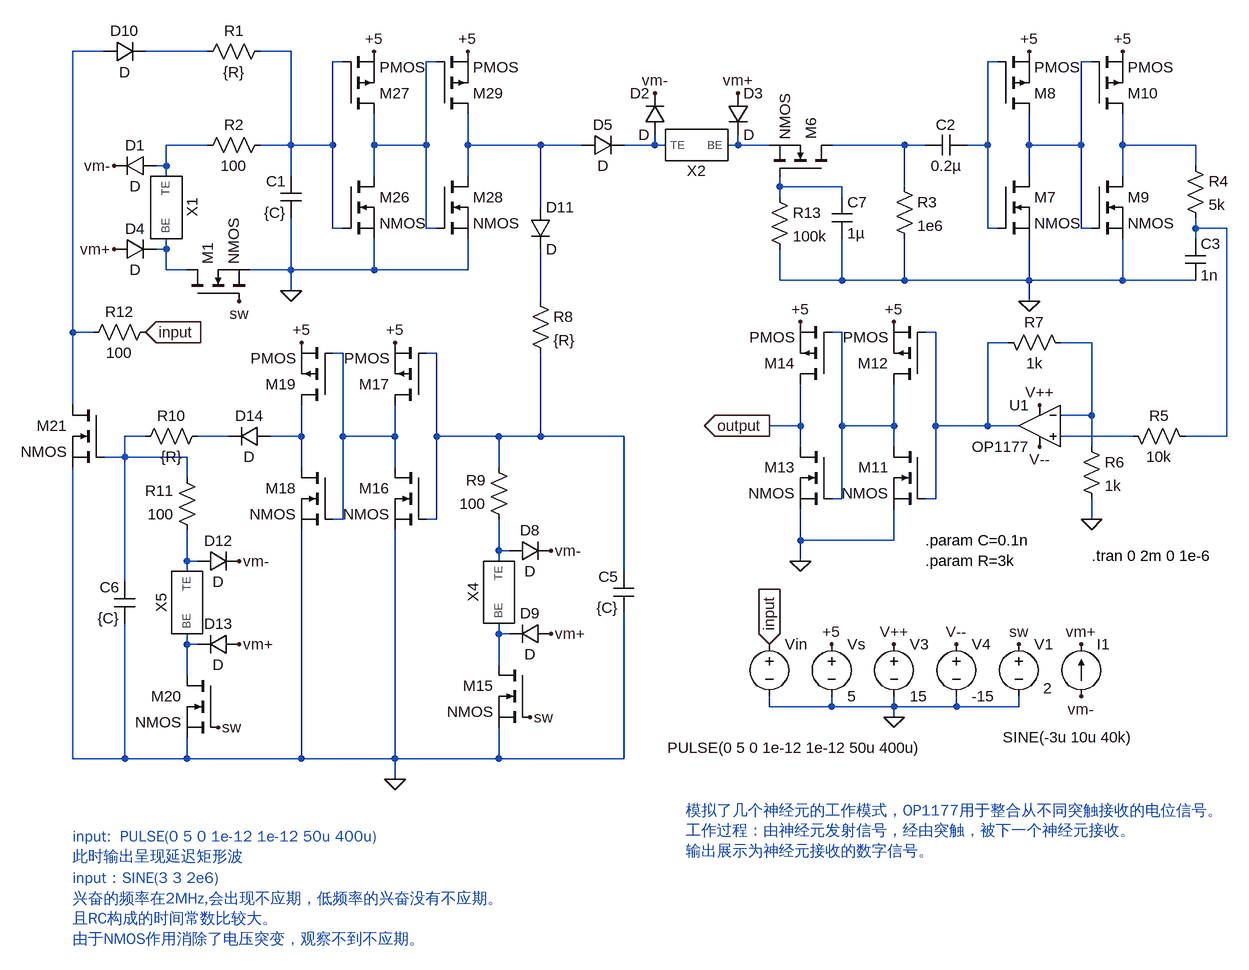
[diagram p0: schematic 神经元-突触-神经元.asc]
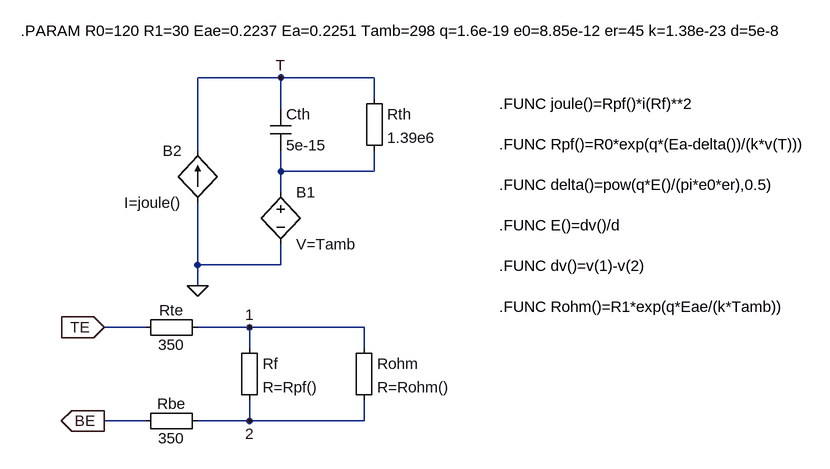
[diagram p1: sub-circuit 神经元拟合.asc]
神经元-突触-神经元.asc, the LTspice schematic file:
Version 4
SHEET 1 2424 1908
WIRE 144 112 96 112
WIRE 304 112 208 112
WIRE 432 112 384 112
WIRE 512 128 496 128
WIRE 656 128 640 128
WIRE 1520 128 1504 128
WIRE 1664 128 1648 128
WIRE 304 256 240 256
WIRE 432 256 432 112
WIRE 432 256 384 256
WIRE 496 256 496 128
WIRE 496 256 432 256
WIRE 560 256 560 208
WIRE 640 256 640 128
WIRE 640 256 560 256
WIRE 704 256 704 208
WIRE 816 256 704 256
WIRE 880 256 816 256
WIRE 992 256 992 240
WIRE 992 256 944 256
WIRE 1008 256 992 256
WIRE 1120 256 1120 240
WIRE 1120 256 1104 256
WIRE 1168 256 1120 256
WIRE 1376 256 1264 256
WIRE 1408 256 1376 256
WIRE 1504 256 1504 128
WIRE 1504 256 1472 256
WIRE 1568 256 1568 208
WIRE 1648 256 1648 128
WIRE 1648 256 1568 256
WIRE 1712 256 1712 208
WIRE 1824 256 1712 256
WIRE 240 288 240 256
WIRE 240 288 224 288
WIRE 1824 288 1824 256
WIRE 240 304 240 288
WIRE 432 304 432 256
WIRE 560 304 560 256
WIRE 704 304 704 256
WIRE 1568 304 1568 256
WIRE 1712 304 1712 256
WIRE 1184 320 1184 304
WIRE 1280 320 1184 320
WIRE 1376 320 1376 256
WIRE 1184 336 1184 320
WIRE 1280 336 1280 320
WIRE 816 352 816 256
WIRE 496 384 496 256
WIRE 512 384 496 384
WIRE 640 384 640 256
WIRE 656 384 640 384
WIRE 1504 384 1504 256
WIRE 1520 384 1504 384
WIRE 1648 384 1648 256
WIRE 1664 384 1648 384
WIRE 1824 384 1824 368
WIRE 1872 384 1824 384
WIRE 1824 400 1824 384
WIRE 240 416 240 400
WIRE 240 416 224 416
WIRE 240 448 240 416
WIRE 272 448 240 448
WIRE 432 448 432 368
WIRE 432 448 368 448
WIRE 560 448 560 400
WIRE 560 448 432 448
WIRE 704 448 704 400
WIRE 704 448 560 448
WIRE 1184 464 1184 416
WIRE 1280 464 1280 400
WIRE 1280 464 1184 464
WIRE 1376 464 1376 400
WIRE 1376 464 1280 464
WIRE 1568 464 1568 400
WIRE 1568 464 1376 464
WIRE 1712 464 1712 400
WIRE 1712 464 1568 464
WIRE 1824 464 1712 464
WIRE 432 480 432 448
WIRE 816 496 816 416
WIRE 1568 496 1568 464
WIRE 96 544 96 112
WIRE 128 544 96 544
WIRE 1280 544 1264 544
WIRE 1424 544 1408 544
WIRE 1536 560 1504 560
WIRE 1664 560 1616 560
WIRE 512 576 496 576
WIRE 656 576 640 576
WIRE 96 656 96 544
WIRE 1664 672 1664 560
WIRE 1664 672 1616 672
WIRE 1216 688 1216 624
WIRE 1216 688 1168 688
WIRE 1280 688 1280 544
WIRE 1360 688 1360 624
WIRE 1360 688 1280 688
WIRE 1424 688 1424 544
WIRE 1504 688 1504 560
WIRE 1504 688 1424 688
WIRE 1552 688 1504 688
WIRE 208 704 176 704
WIRE 336 704 288 704
WIRE 448 704 448 656
WIRE 448 704 400 704
WIRE 512 704 512 576
WIRE 592 704 592 656
WIRE 592 704 512 704
WIRE 656 704 656 576
WIRE 752 704 656 704
WIRE 816 704 816 576
WIRE 816 704 752 704
WIRE 944 704 816 704
WIRE 1728 704 1616 704
WIRE 1872 704 1872 384
WIRE 1872 704 1808 704
WIRE 1216 720 1216 688
WIRE 1360 720 1360 688
WIRE 1664 720 1664 672
WIRE 176 736 176 704
WIRE 176 736 144 736
WIRE 272 736 176 736
WIRE 448 752 448 704
WIRE 592 752 592 704
WIRE 752 752 752 704
WIRE 272 768 272 736
WIRE 1280 800 1280 688
WIRE 1280 800 1264 800
WIRE 1424 800 1424 688
WIRE 1424 800 1408 800
WIRE 512 832 512 704
WIRE 512 832 496 832
WIRE 656 832 656 704
WIRE 656 832 640 832
WIRE 1664 832 1664 800
WIRE 1216 864 1216 816
WIRE 1360 864 1360 816
WIRE 1360 864 1216 864
WIRE 752 880 752 832
WIRE 768 880 752 880
WIRE 272 896 272 848
WIRE 288 896 272 896
WIRE 752 896 752 880
WIRE 1216 896 1216 864
WIRE 272 912 272 896
WIRE 944 912 944 704
WIRE 176 928 176 736
WIRE 752 1008 752 992
WIRE 768 1008 752 1008
WIRE 272 1024 272 1008
WIRE 288 1024 272 1024
WIRE 752 1056 752 1008
WIRE 272 1072 272 1024
WIRE 1168 1120 1168 1104
WIRE 1264 1120 1264 1104
WIRE 1264 1120 1168 1120
WIRE 1360 1120 1360 1104
WIRE 1360 1120 1264 1120
WIRE 1456 1120 1456 1104
WIRE 1456 1120 1360 1120
WIRE 1552 1120 1552 1104
WIRE 1552 1120 1456 1120
WIRE 1360 1136 1360 1120
WIRE 96 1200 96 752
WIRE 176 1200 176 992
WIRE 176 1200 96 1200
WIRE 272 1200 272 1168
WIRE 272 1200 176 1200
WIRE 448 1200 448 848
WIRE 448 1200 272 1200
WIRE 592 1200 592 848
WIRE 592 1200 448 1200
WIRE 752 1200 752 1152
WIRE 752 1200 592 1200
WIRE 944 1200 944 976
WIRE 944 1200 752 1200
WIRE 592 1232 592 1200
FLAG 1648 1024 vm+
FLAG 1648 1104 vm-
FLAG 1552 1024 sw
FLAG 352 496 sw
FLAG 1168 1024 input
IOPIN 1168 1024 In
FLAG 208 544 input
IOPIN 208 544 In
FLAG 1264 1024 +5
FLAG 1360 1024 V++
FLAG 1456 1024 V--
FLAG 1584 656 V++
FLAG 1584 720 V--
FLAG 1168 688 output
IOPIN 1168 688 Out
FLAG 800 1136 sw
FLAG 832 880 vm-
FLAG 832 1008 vm+
FLAG 592 560 +5
FLAG 448 560 +5
FLAG 432 480 0
FLAG 320 1152 sw
FLAG 352 896 vm-
FLAG 352 1024 vm+
FLAG 592 1232 0
FLAG 1360 528 +5
FLAG 1216 528 +5
FLAG 1568 112 +5
FLAG 1712 112 +5
FLAG 992 176 vm-
FLAG 1120 176 vm+
FLAG 560 112 +5
FLAG 704 112 +5
FLAG 160 288 vm-
FLAG 160 416 vm+
FLAG 1360 1136 0
FLAG 1568 496 0
FLAG 1216 896 0
FLAG 1664 832 0
SYMBOL current 1648 1104 R180
WINDOW 0 -44 80 Left 2
WINDOW 3 -80 -63 Left 2
WINDOW 123 0 0 Left 0
WINDOW 39 0 0 Left 0
SYMATTR InstName I1
SYMATTR Value SINE(-3u 10u 40k)
SYMBOL voltage 1552 1008 R0
WINDOW 3 38 84 Left 2
WINDOW 123 0 0 Left 0
WINDOW 39 0 0 Left 0
SYMATTR Value 2
SYMATTR InstName V1
SYMBOL voltage 1168 1008 R0
WINDOW 123 0 0 Left 0
WINDOW 39 0 0 Left 0
WINDOW 3 -157 175 Left 2
SYMATTR Value PULSE(0 5 0 1e-12 1e-12 50u 400u)
SYMATTR InstName Vin
SYMBOL res 288 128 R270
WINDOW 0 32 56 VTop 2
WINDOW 3 0 56 VBottom 2
SYMATTR InstName R1
SYMATTR Value {R}
SYMBOL cap 448 368 R180
WINDOW 0 24 56 Left 2
WINDOW 3 24 8 Left 2
SYMATTR InstName C1
SYMATTR Value {C}
SYMBOL res 400 240 R90
WINDOW 0 0 56 VBottom 2
WINDOW 3 32 56 VTop 2
SYMATTR InstName R2
SYMATTR Value 100
SYMBOL nmos 272 496 R270
SYMATTR InstName M1
SYMBOL voltage 1264 1008 R0
WINDOW 123 0 0 Left 0
WINDOW 39 0 0 Left 0
SYMATTR InstName Vs
SYMATTR Value 5
SYMBOL diode 880 272 R270
WINDOW 0 32 32 VTop 2
WINDOW 3 0 32 VBottom 2
SYMATTR InstName D5
SYMBOL nmos 1264 304 M270
SYMATTR InstName M6
SYMBOL res 1360 304 R0
SYMATTR InstName R3
SYMATTR Value 1e6
SYMBOL cap 1472 240 R90
WINDOW 0 0 32 VBottom 2
WINDOW 3 32 32 VTop 2
SYMATTR InstName C2
SYMATTR Value 0.2µ
SYMBOL res 1808 272 R0
SYMATTR InstName R4
SYMATTR Value 5k
SYMBOL cap 1808 400 R0
SYMATTR InstName C3
SYMATTR Value 1n
SYMBOL res 1712 688 M90
WINDOW 0 0 56 VBottom 2
WINDOW 3 32 56 VTop 2
SYMATTR InstName R5
SYMATTR Value 10k
SYMBOL OpAmps\\OP1177 1584 624 M0
SYMATTR InstName U1
SYMBOL voltage 1360 1008 R0
WINDOW 123 0 0 Left 0
WINDOW 39 0 0 Left 0
SYMATTR InstName V3
SYMATTR Value 15
SYMBOL voltage 1456 1008 R0
WINDOW 123 0 0 Left 0
WINDOW 39 0 0 Left 0
SYMATTR InstName V4
SYMATTR Value -15
SYMBOL res 1520 544 M90
WINDOW 0 0 56 VBottom 2
WINDOW 3 32 56 VTop 2
SYMATTR InstName R7
SYMATTR Value 1k
SYMBOL res 800 480 R0
SYMATTR InstName R8
SYMATTR Value {R}
SYMBOL cap 960 976 R180
WINDOW 0 24 56 Left 2
WINDOW 3 24 8 Left 2
SYMATTR InstName C5
SYMATTR Value {C}
SYMBOL res 768 848 R180
WINDOW 0 36 76 Left 2
WINDOW 3 36 40 Left 2
SYMATTR InstName R9
SYMATTR Value 100
SYMBOL nmos 800 1056 M0
SYMATTR InstName M15
SYMBOL diode 768 896 R270
WINDOW 0 32 32 VTop 2
WINDOW 3 0 32 VBottom 2
SYMATTR InstName D8
SYMBOL diode 832 992 R90
WINDOW 0 0 32 VBottom 2
WINDOW 3 32 32 VTop 2
SYMATTR InstName D9
SYMBOL 神经元拟合 752 944 M90
SYMATTR InstName X4
SYMBOL nmos 640 752 M0
SYMATTR InstName M16
SYMBOL pmos 640 656 R180
SYMATTR InstName M17
SYMBOL nmos 496 752 M0
SYMATTR InstName M18
SYMBOL pmos 496 656 R180
SYMATTR InstName M19
SYMBOL diode 144 128 R270
WINDOW 0 32 32 VTop 2
WINDOW 3 0 32 VBottom 2
SYMATTR InstName D10
SYMBOL diode 800 352 R0
SYMATTR InstName D11
SYMBOL res 192 720 R270
WINDOW 0 32 56 VTop 2
WINDOW 3 0 56 VBottom 2
SYMATTR InstName R10
SYMATTR Value {R}
SYMBOL cap 192 992 R180
WINDOW 0 24 56 Left 2
WINDOW 3 24 8 Left 2
SYMATTR InstName C6
SYMATTR Value {C}
SYMBOL res 288 864 R180
WINDOW 0 36 76 Left 2
WINDOW 3 36 40 Left 2
SYMATTR InstName R11
SYMATTR Value 100
SYMBOL nmos 320 1072 M0
SYMATTR InstName M20
SYMBOL diode 288 912 R270
WINDOW 0 32 32 VTop 2
WINDOW 3 0 32 VBottom 2
SYMATTR InstName D12
SYMBOL diode 352 1008 R90
WINDOW 0 0 32 VBottom 2
WINDOW 3 32 32 VTop 2
SYMATTR InstName D13
SYMBOL 神经元拟合 272 960 M90
SYMATTR InstName X5
SYMBOL diode 400 688 R90
WINDOW 0 0 32 VBottom 2
WINDOW 3 32 32 VTop 2
SYMATTR InstName D14
SYMBOL nmos 144 656 M0
SYMATTR InstName M21
SYMBOL res 224 528 R90
WINDOW 0 0 56 VBottom 2
WINDOW 3 32 56 VTop 2
SYMATTR InstName R12
SYMATTR Value 100
SYMBOL res 1168 320 R0
SYMATTR InstName R13
SYMATTR Value 100k
SYMBOL cap 1264 336 R0
SYMATTR InstName C7
SYMATTR Value 1µ
SYMBOL nmos 1408 720 M0
SYMATTR InstName M11
SYMBOL pmos 1408 624 R180
SYMATTR InstName M12
SYMBOL nmos 1264 720 M0
SYMATTR InstName M13
SYMBOL pmos 1264 624 R180
SYMATTR InstName M14
SYMBOL nmos 1520 304 R0
SYMATTR InstName M7
SYMBOL pmos 1520 208 M180
SYMATTR InstName M8
SYMBOL nmos 1664 304 R0
SYMATTR InstName M9
SYMBOL pmos 1664 208 M180
SYMATTR InstName M10
SYMBOL diode 1008 240 R180
WINDOW 0 24 64 Left 2
WINDOW 3 24 0 Left 2
SYMATTR InstName D2
SYMBOL diode 1104 176 R0
SYMATTR InstName D3
SYMBOL 神经元拟合 1056 256 M180
SYMATTR InstName X2
SYMBOL nmos 512 304 R0
SYMATTR InstName M26
SYMBOL pmos 512 208 M180
SYMATTR InstName M27
SYMBOL nmos 656 304 R0
SYMATTR InstName M28
SYMBOL pmos 656 208 M180
SYMATTR InstName M29
SYMBOL diode 224 304 M270
WINDOW 0 32 32 VTop 2
WINDOW 3 0 32 VBottom 2
SYMATTR InstName D1
SYMBOL diode 160 400 M90
WINDOW 0 0 32 VBottom 2
WINDOW 3 32 32 VTop 2
SYMATTR InstName D4
SYMBOL 神经元拟合 240 352 R90
SYMATTR InstName X1
SYMBOL res 1648 704 R0
SYMATTR InstName R6
SYMATTR Value 1k
TEXT 1664 888 Left 2 !.tran 0 2m 0 1e-6
TEXT 1408 864 Left 2 !.param C=0.1n\n.param R=3k
TEXT 96 1320 Left 2 ;input:  PULSE(0 5 0 1e-12 1e-12 50u 400u)\n此时输出呈现延迟矩形波
TEXT 96 1384 Left 2 ;input：SINE(3 3 2e6)\n兴奋的频率在2MHz,会出现不应期，低频率的兴奋没有不应期。\n且RC构成的时间常数比较大。\n由于NMOS作用消除了电压突变，观察不到不应期。
TEXT 1040 1280 Left 2 ;模拟了几个神经元的工作模式，OP1177用于整合从不同突触接收的电位信号。\n工作过程：由神经元发射信号，经由突触，被下一个神经元接收。\n输出展示为神经元接收的数字信号。

神经元拟合.asc, the sub-circuit schematic file:
Version 4
SHEET 1 2180 680
WIRE 304 -288 176 -288
WIRE 448 -288 304 -288
WIRE 448 -256 448 -288
WIRE 304 -240 304 -288
WIRE 176 -176 176 -288
WIRE 304 -144 304 -176
WIRE 448 -144 448 -176
WIRE 448 -144 304 -144
WIRE 304 -112 304 -144
WIRE 176 0 176 -96
WIRE 304 0 304 -32
WIRE 304 0 176 0
WIRE 176 32 176 0
WIRE 96 96 32 96
WIRE 256 96 176 96
WIRE 432 96 256 96
WIRE 256 128 256 96
WIRE 432 128 432 96
WIRE 96 240 32 240
WIRE 256 240 256 208
WIRE 256 240 176 240
WIRE 432 240 432 208
WIRE 432 240 256 240
FLAG 176 32 0
FLAG 304 -288 T
FLAG 256 96 1
FLAG 256 240 2
FLAG 32 96 TE
IOPIN 32 96 In
FLAG 32 240 BE
IOPIN 32 240 Out
SYMBOL cap 288 -240 R0
SYMATTR InstName Cth
SYMATTR Value 5e-15
SYMBOL Misc\\EuropeanResistor 432 -272 R0
SYMATTR InstName Rth
SYMATTR Value 1.39e6
SYMBOL Misc\\EuropeanResistor 240 112 R0
SYMATTR InstName Rf
SYMATTR Value R=Rpf()
SYMBOL Misc\\EuropeanResistor 416 112 R0
SYMATTR InstName Rohm
SYMATTR Value R=Rohm()
SYMBOL Misc\\EuropeanResistor 192 80 R90
WINDOW 0 5 56 VBottom 2
WINDOW 3 27 56 VTop 2
SYMATTR InstName Rte
SYMATTR Value 350
SYMBOL Misc\\EuropeanResistor 192 224 R90
WINDOW 0 5 56 VBottom 2
WINDOW 3 27 56 VTop 2
SYMATTR InstName Rbe
SYMATTR Value 350
SYMBOL bv 304 -128 R0
SYMATTR InstName B1
SYMATTR Value V=Tamb
SYMBOL bi 176 -96 R180
WINDOW 0 24 80 Left 2
WINDOW 3 24 0 Left 2
SYMATTR InstName B2
SYMATTR Value I=joule()
TEXT 640 -248 Left 2 !.FUNC joule()=Rpf()*i(Rf)**2\n \n.FUNC Rpf()=R0*exp(q*(Ea-delta())/(k*v(T)))\n \n.FUNC delta()=pow(q*E()/(pi*e0*er),0.5)\n \n.FUNC E()=dv()/d\n \n.FUNC dv()=v(1)-v(2)\n \n.FUNC Rohm()=R1*exp(q*Eae/(k*Tamb))
TEXT -96 -360 Left 2 !.PARAM R0=120 R1=30 Eae=0.2237 Ea=0.2251 Tamb=298 q=1.6e-19 e0=8.85e-12 er=45 k=1.38e-23 d=5e-8

The netlist it stands for:
* 神经元-突触-神经元.asc
I1 vm- vm+ SINE(-3u 10u 40k)
V1 sw 0 2
Vin input 0 PULSE(0 5 0 1e-12 1e-12 50u 400u)
R1 N002 N003 {R}
C1 0 N003 {C}
R2 N003 N007 100
M1 N015 sw 0 0 NMOS
Vs +5 0 5
D5 N008 N009 D
M6 N011 N013 N010 N010 NMOS
R3 N011 0 1e6
C2 N005 N011 0.2µ
R4 N012 N014 5k
C3 N014 0 1n
R5 N025 N014 10k
XU1 N025 N019 V++ V-- N018 OP1177  ; pins In+ In- V+ V- OUT
V3 V++ 0 15
V4 V-- 0 -15
R7 N018 N019 1k
R8 N016 N021 {R}
C5 0 N021 {C}
R9 N026 N021 100
M15 N028 sw 0 0 NMOS
D8 N026 vm- D
D9 vm+ N028 D
XX4 N026 N028 神经元拟合
M16 N020 N021 0 0 NMOS
M17 N020 N021 +5 +5 PMOS
M18 N024 N020 0 0 NMOS
M19 N024 N020 +5 +5 PMOS
D10 N001 N002 D
D11 N008 N016 D
R10 N022 N023 {R}
C6 0 N022 {C}
R11 N027 N022 100
M20 N029 sw 0 0 NMOS
D12 N027 vm- D
D13 vm+ N029 D
XX5 N027 N029 神经元拟合
D14 N024 N023 D
M21 N001 N022 0 0 NMOS
R12 input N001 100
R13 N013 0 100k
C7 N013 0 1µ
M11 N017 N018 0 0 NMOS
M12 N017 N018 +5 +5 PMOS
M13 output N017 0 0 NMOS
M14 output N017 +5 +5 PMOS
M7 N006 N005 0 0 NMOS
M8 N006 N005 +5 +5 PMOS
M9 N012 N006 0 0 NMOS
M10 N012 N006 +5 +5 PMOS
D2 N009 vm- D
D3 vm+ N010 D
XX2 N009 N010 神经元拟合
M26 N004 N003 0 0 NMOS
M27 N004 N003 +5 +5 PMOS
M28 N008 N004 0 0 NMOS
M29 N008 N004 +5 +5 PMOS
D1 N007 vm- D
D4 vm+ N015 D
XX1 N007 N015 神经元拟合
R6 N019 0 1k

* block symbol definitions
.subckt 神经元拟合 TE BE
Cth T N001 5e-15
Rth T N001 1.39e6
Rf 1 2 R=Rpf()
Rohm 1 2 R=Rohm()
Rte 1 TE 350
Rbe 2 BE 350
B1 N001 0 V=Tamb
B2 0 T I=joule()
.FUNC joule()=Rpf()*i(Rf)**2
.FUNC Rpf()=R0*exp(q*(Ea-delta())/(k*v(T)))
.FUNC delta()=pow(q*E()/(pi*e0*er),0.5)
.FUNC E()=dv()/d
.FUNC dv()=v(1)-v(2)
.FUNC Rohm()=R1*exp(q*Eae/(k*Tamb))
.PARAM R0=120 R1=30 Eae=0.2237 Ea=0.2251 Tamb=298 q=1.6e-19 e0=8.85e-12 er=45 k=1.38e-23 d=5e-8
.ends 神经元拟合

.model D D
.lib standard.dio
.model NMOS NMOS
.model PMOS PMOS
.lib standard.mos
.tran 0 2m 0 1e-6
.param C=0.1n
.param R=3k
* input:  PULSE(0 5 0 1e-12 1e-12 50u 400u)
* 此时输出呈现延迟矩形波
* input：SINE(3 3 2e6)
* 兴奋的频率在2MHz,会出现不应期，低频率的兴奋没有不应期。
* 且RC构成的时间常数比较大。
* 由于NMOS作用消除了电压突变，观察不到不应期。
* 模拟了几个神经元的工作模式，OP1177用于整合从不同突触接收的电位信号。
* 工作过程：由神经元发射信号，经由突触，被下一个神经元接收。
* 输出展示为神经元接收的数字信号。
.lib ADI1.lib
.backanno
.end